# EAGLE schematic p1am-proto-iso-rs485-v1 (EAGLE 7.7.0)
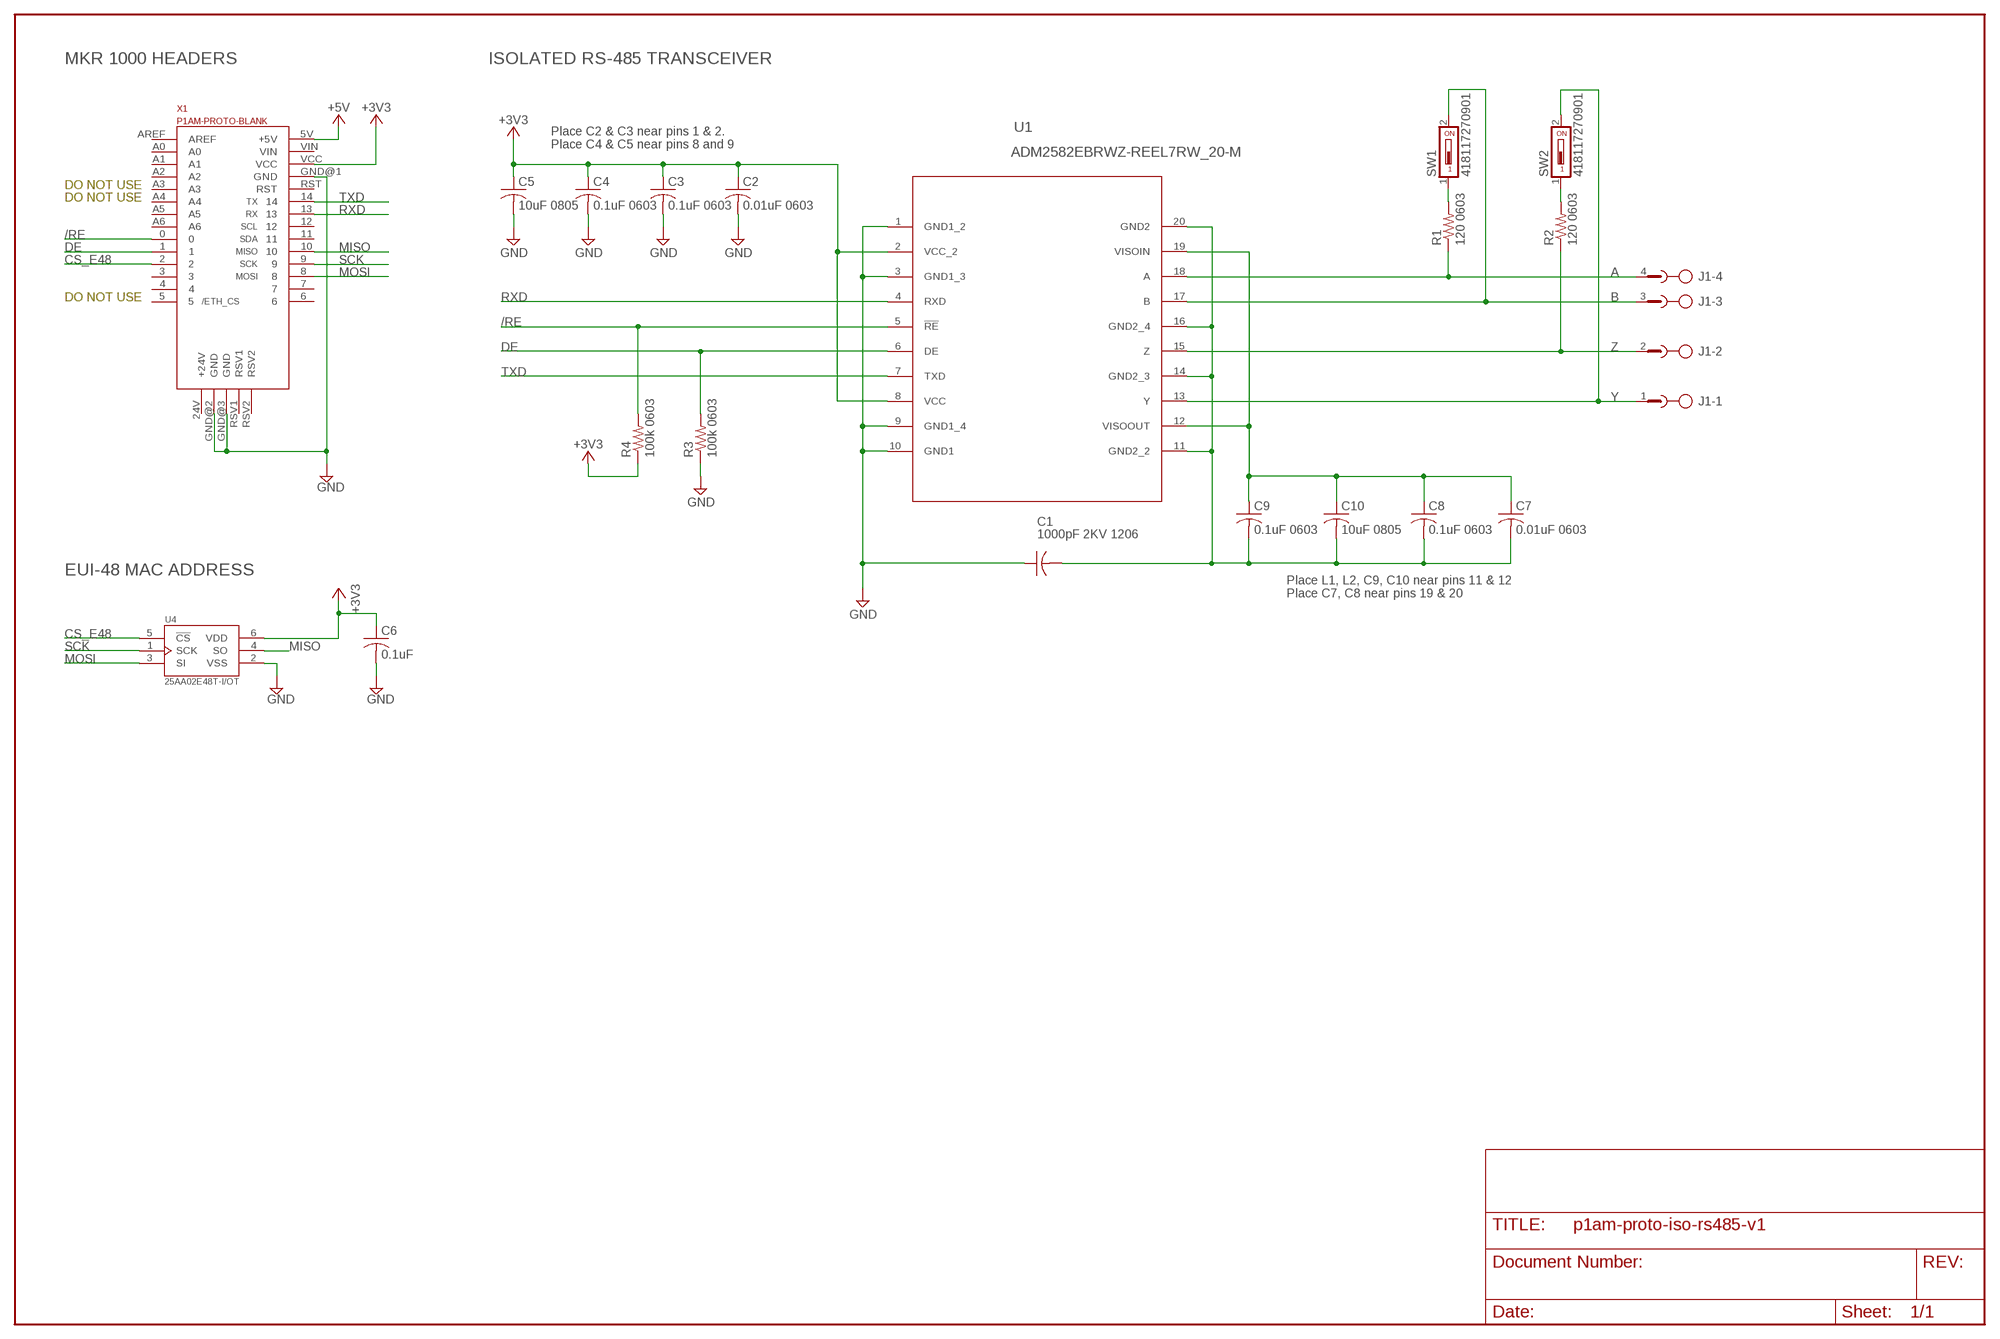
[diagram p0: schematic, sheet 1]

## Parts
C1  1000pF 2KV 1206  C-USC1206K  [C1206K]
C2  0.01uF 0603  C-USC0603K  [C0603K]
C3  0.1uF 0603  C-USC0603K  [C0603K]
C4  0.1uF 0603  C-USC0603K  [C0603K]
C5  10uF 0805  C-USC0805K  [C0805K]
C6  0.1uF  C-USC0603  [C0603]
C7  0.01uF 0603  C-USC0603K  [C0603K]
C8  0.1uF 0603  C-USC0603K  [C0603K]
C9  0.1uF 0603  C-USC0603K  [C0603K]
C10  10uF 0805  C-USC0805K  [C0805K]
J1  PHOENIX-XXXXXXX-TERM-BLOCK-HDR-4POS-90DEG-3.5MM  [PHOENIX-XXXXXXX-TERM-BLOCK-HDR-4POS-90DEG-3.5MM]
R1  120 0603  R-US_R0603  [R0603]
R2  120 0603  R-US_R0603  [R0603]
R3  100k 0603  R-US_R0603  [R0603]
R4  100k 0603  R-US_R0603  [R0603]
SW1  418117270901  [DIP-01-PTH]
SW2  418117270901  [DIP-01-PTH]
U1  ADM2582EBRWZ-REEL7RW_20-M  [RW_20-M]
U4  25AA02E48T-I/OT  [SOT95P270X145-6N]
X1  P1AM-PROTO-BLANK  [P1AM-PROTO-BLANK]

## Nets
+3V3: C2.1 C3.1 C4.1 C5.1 C6.1 R4.1 U1.2(VCC_2) U1.8(VCC) U4.6(VDD) X1.VCC
+5V: X1.5V(+5V)
/RE: R4.2 U1.5(!RE) X1.0
A: J1.4 R1.1 U1.18(A)
B: J1.3 SW1.2 U1.17(B)
CS_E48: U4.5(!CS) X1.2
DE: R3.2 U1.6(DE) X1.1
GND: C1.1 C2.2 C3.2 C4.2 C5.2 C6.2 R3.1 U1.1(GND1_2) U1.3(GND1_3) U1.9(GND1_4) U1.10(GND1) U4.2(VSS) X1.GND@1(GND) X1.GND@2(GND) X1.GND@3(GND)
ISOGND: C1.2 C7.2 C8.2 C9.2 C10.2 U1.11(GND2_2) U1.14(GND2_3) U1.16(GND2_4) U1.20(GND2)
ISOVCC: C7.1 C8.1 C9.1 C10.1 U1.12(VISOOUT) U1.19(VISOIN)
MISO: U4.4(SO) X1.10
MOSI: U4.3(SI) X1.8
N$7: R1.2 SW1.1
N$8: R2.2 SW2.1
RXD: U1.4(RXD) X1.13
SCK: U4.1(SCK) X1.9
TXD: U1.7(TXD) X1.14
Y: J1.1 SW2.2 U1.13(Y)
Z: J1.2 R2.1 U1.15(Z)
Unconnected: X1.3 X1.4 X1.5 X1.6 X1.7 X1.11 X1.12 X1.24V(+24V) X1.A0 X1.A1 X1.A2 X1.A3 X1.A4 X1.A5 X1.A6 X1.AREF X1.RST X1.RSV1 X1.RSV2 X1.VIN

## Notes on the sheet
- MKR 1000 HEADERS | ISOLATED RS-485 TRANSCEIVER
- Place C2 & C3 near pins 1 & 2.
  Place C4 & C5 near pins 8 and 9
- DO NOT USE
- DO NOT USE | TX
- RX
- SCL
- SDA
- MISO
- SCK
- MOSI
- DO NOT USE | /ETH_CS
- EUI-48 MAC ADDRESS
- Place L1, L2, C9, C10 near pins 11 & 12
  Place C7, C8 near pins 19 & 20

## Library data of the parts
C1-C10 = rcl:C-US: CAPACITOR, American symbol
J1 = phoenix-term-block-hdr:PHOENIX-XXXXXXX-TERM-BLOCK-HDR-4POS-90DEG-3.5MM
R1-R4 = rcl:R-US_: RESISTOR, American symbol
SW1 SW2 = dip-switch-wurth- 418117270901:418117270901
U1 = ADM2582EBRWZ-REEL7:ADM2582EBRWZ-REEL7; BUILT_BY: EMA_UL_Team; COPYRIGHT: Copyright (C) 2018 Accelerated Designs. All rights reserved; MANUFACTURER_PART_NUMBER: ADM2582EBRWZ-REEL7; VENDOR: Analog Devices Inc
U4 = 25AA02E48T-I_OT:25AA02E48T-I/OT: 25AA02E48 Series 2 Kbit (256 x 8) 5.5 V SMT SPI Bus Serial EEPROM - SOT-23-6; DESCRIPTION: 25AA02E48 Series 2 Kbit _256 x 8_ 5.5 V SMT SPI Bus Serial EEPROM - SOT-23-6; DIGI-KEY_PART_NUMBER: 25AA02E48T-I/OTCT-ND; DIGI-KEY_PURCHASE_URL: https://www.digikey.com/product-detail/en/microchip-technology/25AA02E48T-I-OT/25AA02E48T-I-OTCT-ND/2060055?utm_source=snapeda&utm_medium=aggregator&utm_campaign=symbol; MF: Microchip; MP: 25AA02E48T-I/OT; PACKAGE: SOT-23-6 Microchip
X1 = P1AM-PROTO-BLANK:P1AM-PROTO-BLANK